# EAGLE design LB_BIT_o4_VIBRATIONMOTOR-v02(rev1) (EAGLE 6.6.0)
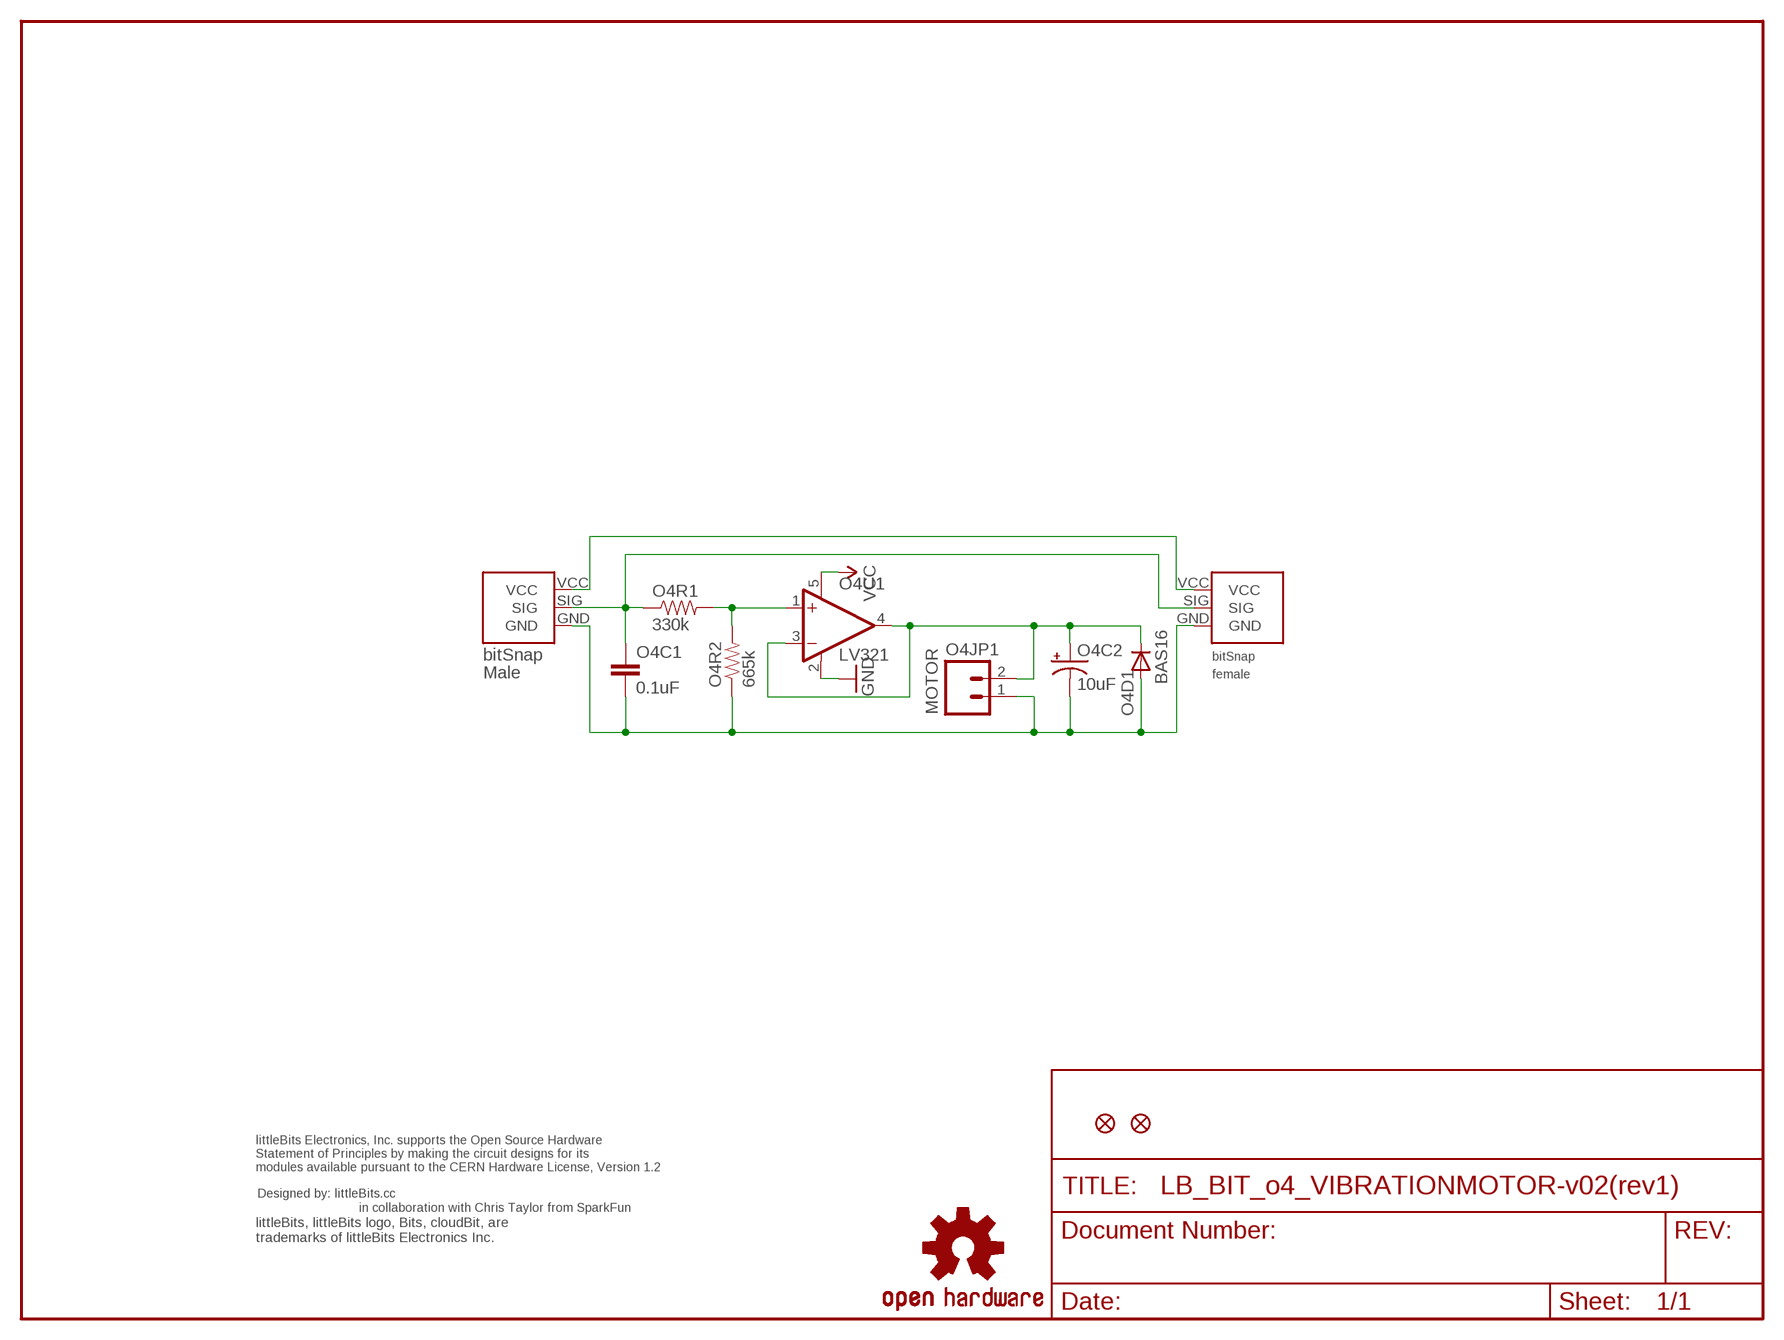
[diagram p0: schematic, sheet 1]

## Parts
JP2  FIDUCIAL1X2.5  [FIDUCIAL-1X2.5]
JP3  FIDUCIAL1X2.5  [FIDUCIAL-1X2.5]
O4BSF  BITSNAP_FEMALE  [BITSNAP_FEMALE]
O4BSM  BITSNAP_MALE  [BITSNAP_MALE]
O4C1  0.1uF  CAP0603-CAP  [0603-CAP]
O4C2  10uF  CAP_POL1206  [EIA3216]
O4D1  BAS16  DIODESOT23  [SOT23-3]
O4JP1  MOTOR  M02PTH  [1X02]
O4R1  330k  RESISTOR0603-RES  [0603-RES]
O4R2  665k  RESISTOR0603-RES  [0603-RES]
O4U1  LV321  [SC70-5]
U$1  OSHWCREDIT  [OSHWCREDIT]
U$5  OSHW-LOGOL  [OSHW-LOGO-L]

## Nets
GND: O4BSF.GND O4BSM.GND O4C1.2 O4C2.C(-) O4D1.1(A) O4JP1.1 O4R2.1 O4U1.2(V-)
N$2: O4C2.A(+) O4D1.3(C) O4JP1.2 O4U1.3(-IN) O4U1.4(OUT)
N$5: O4R1.2 O4R2.2 O4U1.1(+IN)
SIG: O4BSF.SIG O4BSM.SIG O4C1.1 O4R1.1
VCC: O4BSF.VCC O4BSM.VCC O4U1.5(V+)

## Notes on the sheet
- in collaboration with Chris Taylor from SparkFun

## Library data of the parts
JP2 JP3 = abes:FIDUCIAL: Fiducial Alignment Points Various fiducial points for machine vision alignment.
O4BSF = bitSnap:BITSNAP_FEMALE
O4BSM = bitSnap:BITSNAP_MALE
O4C1 = SparkFun:CAP: Capacitor Standard 0603 ceramic capacitor, and 0.1" leaded capacitor.
O4C2 = SparkFun:CAP_POL: Capacitor Polarized These are standard SMD and PTH capacitors. Normally 10uF, 47uF, and 100uF in electrolytic and tantalum varieties. Always verify the external diameter of the through hole cap, it varies with capacity, voltage, and manufacturer. The EIA devices should be standard.
O4D1 = SparkFun:DIODE: Diode These are standard reverse protection diodes and small signal diodes. SMA package can handle up to about 1A. SOD-323 can handle about 200mA. What the SOD-323 package when ordering, there are some mfgs out there that are 5-pin packages.
O4JP1 = SparkFun:M02: Header 2 Standard 2-pin 0.1" header. Use with straight break away headers (SKU : PRT-00116), right angle break away headers (PRT-00553), swiss pins (PRT-00743), machine pins (PRT-00117), and female headers (PRT-00115). Molex polarized connector foot print use with SKU : PRT-08233 with associated crimp pins and housings.
O4R1 O4R2 = SparkFun:RESISTOR: Resistor Basic schematic elements and footprints for 0603, 1206, and PTH 1/10th watt (small) resistors.
O4U1 = LITTLEBITS:LV321
U$1 = LITTLEBITS:OSHWCREDIT
U$5 = SparkFun:OSHW-LOGO: Open Source Hardware Logo This logo indicates the piece of hardware it is found on incorporates a OSHW license and/or adheres to the definition of open source hardware found here: http://freedomdefined.org/OSHW

## Board
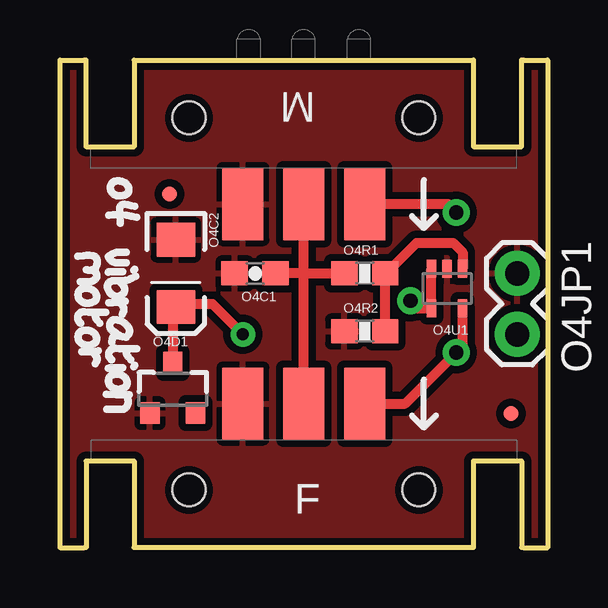
[diagram p1: board, top side]
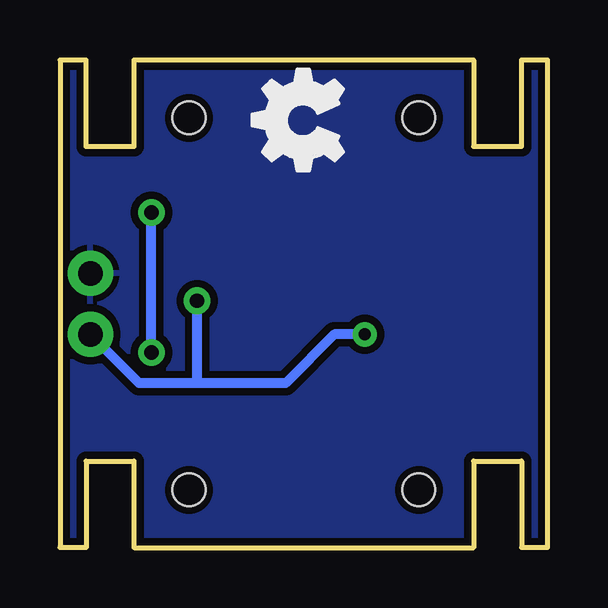
[diagram p2: board, bottom side, seen from below]

Size 20.32 x 20.32 mm. Coordinates in mm from the lower left corner, seen from the top.
Outline: 1.02,0 0,0 0,20.32 1.02,20.32
Outline: 19.3,0 20.32,0 20.32,20.32 19.3,20.32
Copper layers (1*16): Top 0.035mm / dielectric 1.5mm / Bottom 0.035mm
Design rules "default": minimum track width 8mil, minimum drill 20mil, track to track 8mil, track to pad 8mil, pad to pad 8mil, via to via 8mil, smd to smd 8mil, copper to edge 10mil, drill to drill 8mil, minimum pad ring 12mil, minimum via ring 10mil, stop-mask expansion 4mil, vias tented up to drill 25mil, thermal gap 10mil

### Footprints (pad centres in the part's own frame; a part is rotated, then mirrored left to right if it is on the bottom)
FIDUCIAL-1X2.5 = smd 0.635 x 0.635: 1 0,0
BITSNAP_FEMALE = smd 1.7 x 3: GND 6.35,6; SIG 8.89,6; VCC 11.43,6 | hole 1.37: 13.68,2.41; 4.1,2.41
BITSNAP_MALE = smd 1.7 x 3: GND 11.43,6; SIG 8.89,6; VCC 6.35,6 | hole 1.37: 13.68,2.41; 4.1,2.41
0603-CAP = smd 1.1 x 1: 1 -0.85,0; 2 0.85,0
EIA3216 = smd 1.4 x 1.6: A 1.4,0; C -1.4,0
SOT23-3 = smd 0.8 x 0.9: 1 -0.95,-1; 2 0.95,-1; 3 0,1.1
1X02 = drill 1.016 pad 1.88: 1 0,0; 2 2.54,0
0603-RES = smd 1.1 x 1: 1 -0.85,0; 2 0.85,0
SC70-5 = smd 0.4 x 0.75: 1 -0.65,-0.825; 2 0,-0.825; 3 0.65,-0.825; 4 0.65,0.825; 5 -0.65,0.825

### Placement (x,y rotation side)
JP2  4.57,14.73 0 top
JP3  18.8,5.59 0 top
O4BSF  1.27,0 0 top
O4BSM  19.05,20.32 180 top
O4C1  8.13,11.43 180 top
O4C2  4.83,11.43 270 top
O4D1  4.7,6.6 0 top
O4JP1  19.05,11.43 270 top
O4R1  12.7,11.43 0 top
O4R2  12.7,9.02 0 top
O4U1  16.13,10.79 180 top
U$1  -16.51,-22.86 0 top  (outside the outline)
U$4  [OSHW_FILLX150_NOTEXT]  8.51,14.86 0 top
U$5  -12.7,-10.16 0 top  (outside the outline)

### Tracks (layer width: path | path; a pad name or v marks a point on that pad's centre or on a via)
GND
  pour Bottom (isolate 0.305): 0,20.32 0,0 20.32,0 20.32,20.32
  pour Top (isolate 0.305): 0,20.32 0,0 20.32,0 20.32,20.32
N$2  (via drill 0.51, 0.6)
  Top 0.406: v7.62,8.89 7.49,8.76 7.49,9.02 6.35,10.16 4.96,10.16 O4C2.A 4.7,9.9 O4D1.3 | O4U1.3 O4U1.4 14.92,9.97 v14.61,10.29
  Bottom 0.406: v7.62,8.89 8.89,8.89 10.92,6.86 14.61,6.86 | 14.61,6.86 17.02,6.86 O4JP1.2 | 14.61,6.86 v14.61,10.29
N$5
  Top 0.406: O4R2.2 O4R1.2 13.59,11.43 14.86,12.7 16.38,12.7 16.78,12.3 O4U1.1
SIG
  Top 0.406: O4BSF.SIG 10.16,11.43 | 10.16,11.43 O4BSM.SIG | 10.16,11.43 O4C1.1 | 10.16,11.43 O4R1.1
VCC  (via drill 0.6)
  Top 0.406: O4BSF.VCC 14.38,6 v16.51,8.13 16.78,8.4 O4U1.5 | O4BSM.VCC 16.16,14.32 v16.51,13.97
  Bottom 0.406: v16.51,8.13 v16.51,13.97

### Text on the board
dxf: in collaboration with Chris Taylor from SparkFun